# Altium schematic sheet SmartChargerV3.SchDoc
size 594 x 420 mm; SheetNumber: 1; SheetTotal: 1
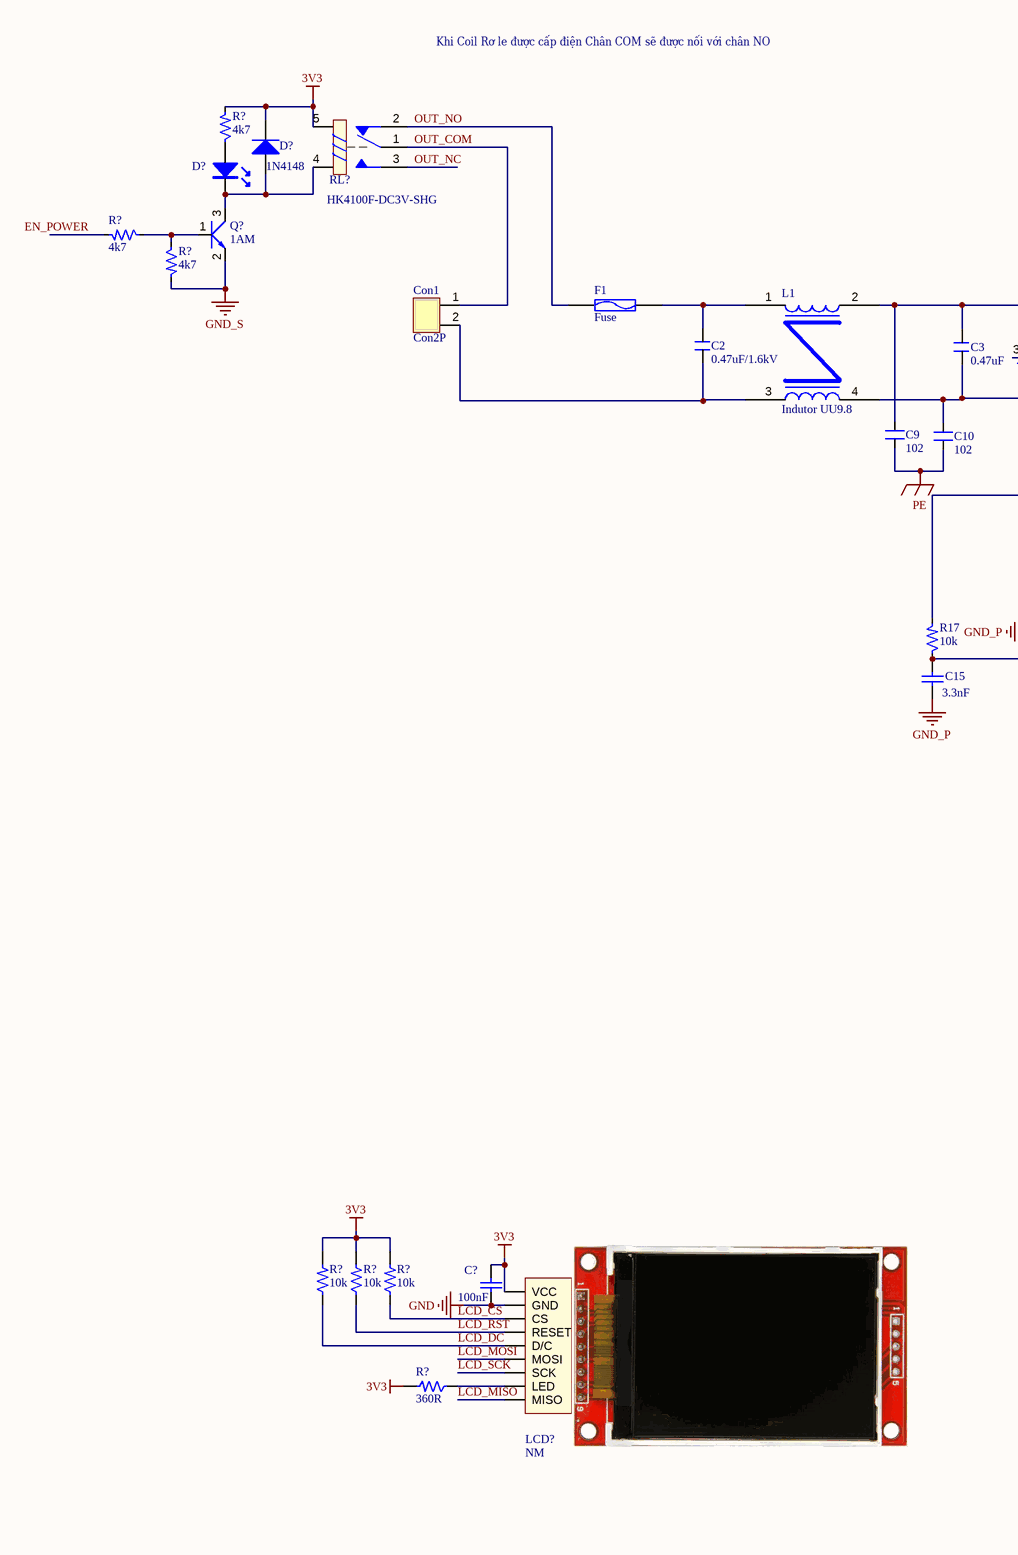
[diagram p0: SmartChargerV3.SchDoc, left]
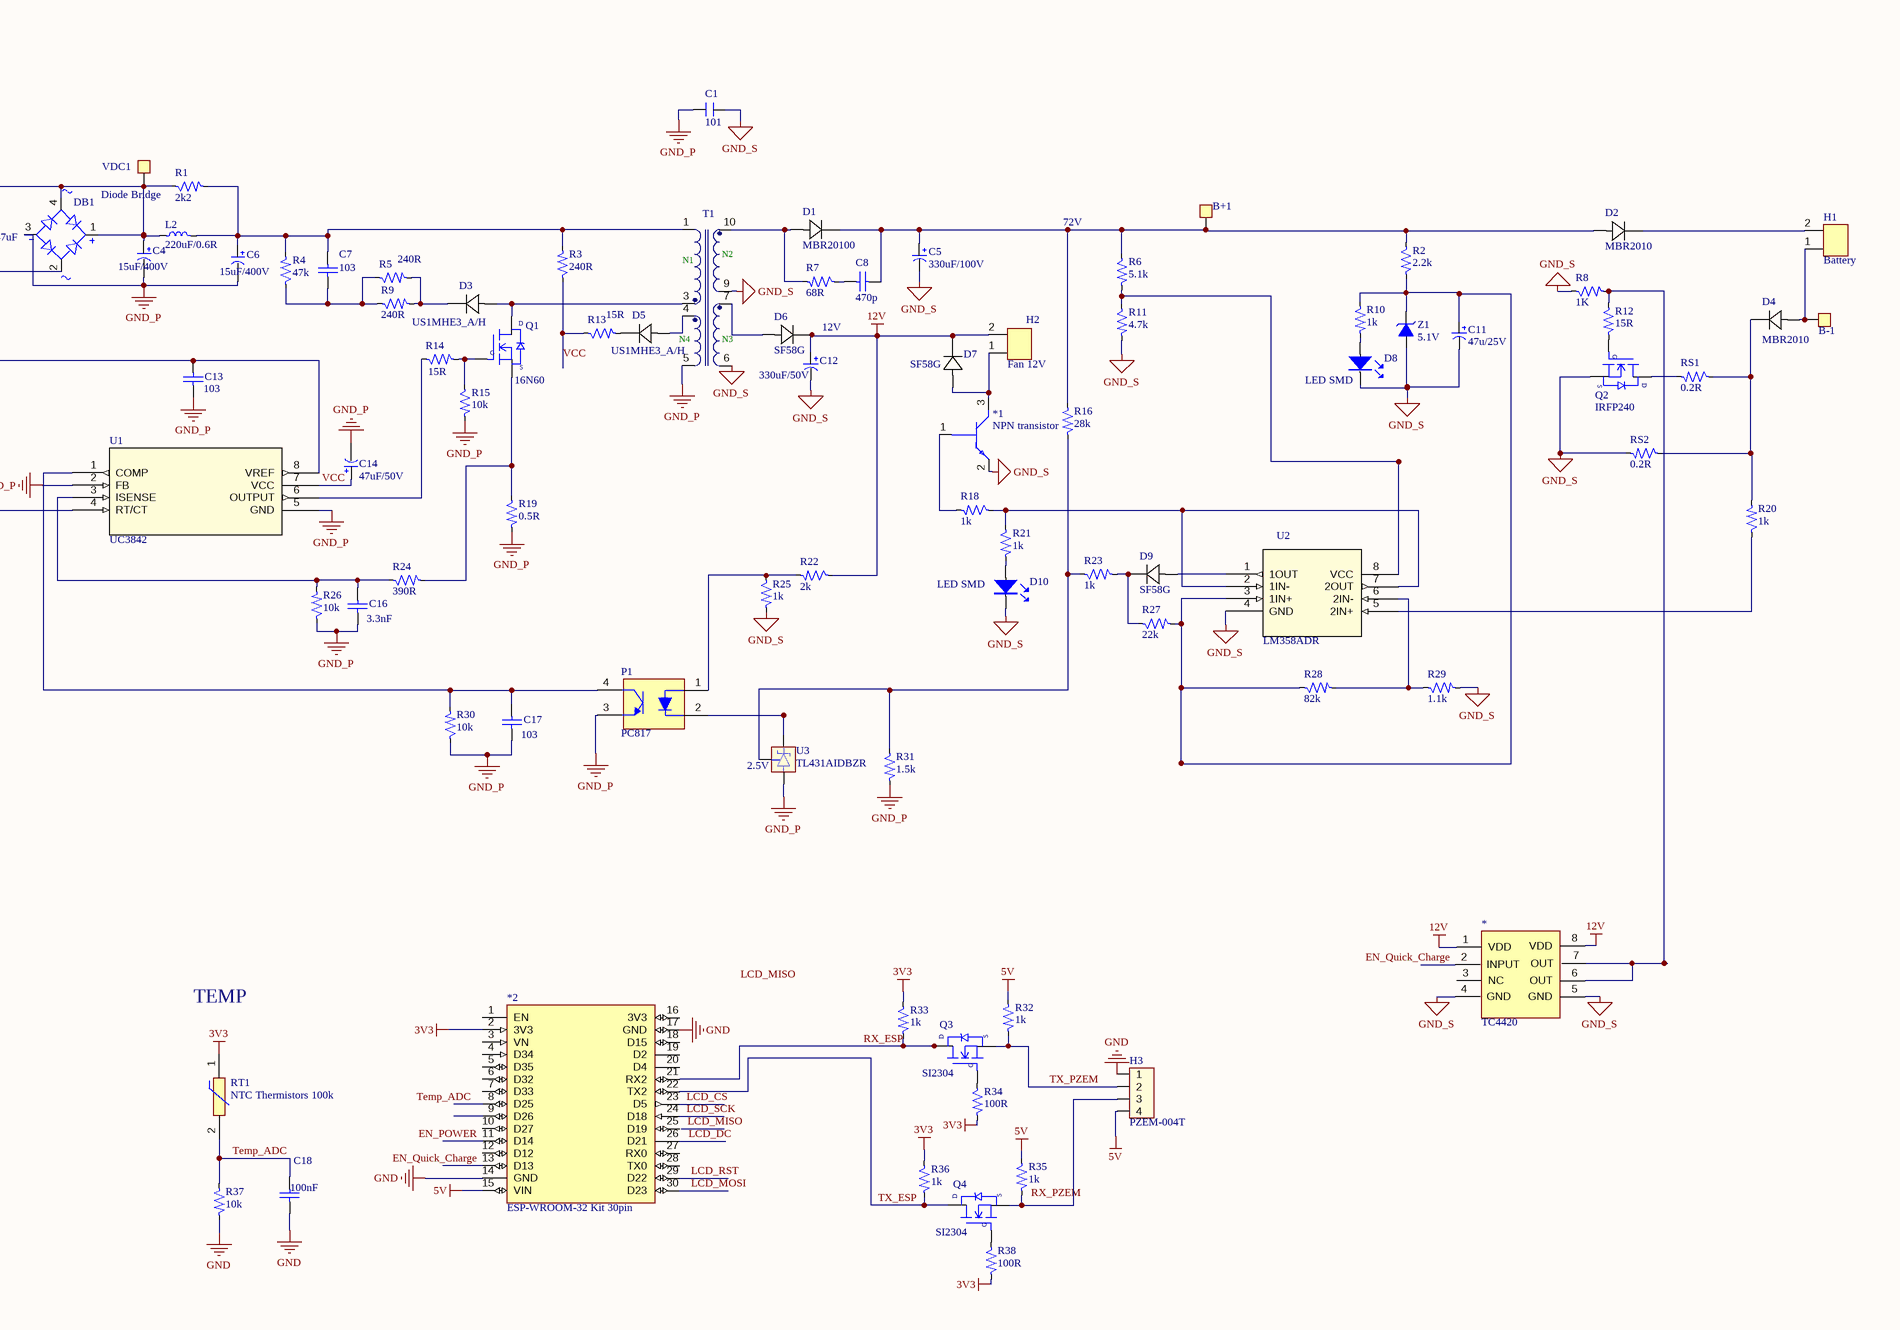
[diagram p1: SmartChargerV3.SchDoc, right]

## Parts
(Parts that share a designator on the sheet are numbered #1, #2 ... from top to bottom, then left to right.)
*  TC4420  [SOIC-8 127P 600X175]
*1  NPN transistor
*2  ESP-WROOM-32 Kit 30pin  [ESP-WROOM-32]
B+1  TEST POINT  [TEST POINT]  (value not drawn)
B-1  TEST POINT  [TEST POINT]  (value not drawn)
C1  101  [CN3]
C2  0.47uF/1.6kV  [Cap CBB]
C3  0.47uF  [Cap CBB]
C4  15uF/400V  [CAP 47uF 400V]
C5  330uF/100V  [CAP-ALU-SMD_B-4.0x5.4]
C6  15uF/400V  [CAP 47uF 400V]
C7  103  [CAP-SMD-0805]
C8  470p  [CAP-SMD-1206]
C9  102  [C-SE-7,5x10x9x5x4]
C10  102  [C-SE-7,5x10x9x5x4]
C11  47u/25V  [CAP-ALU-SMD_B-4.0x5.4]
C12  330uF/50V  [CAP-ALU-SMD_B-4.0x5.4]
C13  103  [CAP-SMD-1206]
C14  47uF/50V  [CAP 47uF 400V]
C15  3.3nF  [CAP-SMD-1206]
C16  3.3nF  [CAP-SMD-1206]
C17  103  [CAP-SMD-1206]
C18  100nF  [CAP-SMD-0603]
C?  100nF  [CAP-SMD-0603]
Con1  Con2P  [Con2 APES]
D1  MBR20100  [DO-214AC]
D2  MBR2010  [DO-214AC]
D3  US1MHE3_A/H  [DO-214AC]
D4  MBR2010  [DO-214AC]
D5  US1MHE3_A/H  [DO-214AC]
D6  SF58G  [DO-214AC]
D7  SF58G  [DO-214AC]
D8  LED SMD  [LED-0805-Blue]
D9  SF58G  [DO-214AC]
D10  LED SMD  [LED-0805-Blue]
D?#1  1N4148  [D-SMD-123]
D?#2  YELL  [LED-0603-Yellow]  (value not drawn)
DB1  Diode Bridge  [DIOB_MB10F-13]
F1  Fuse  [Fuse]
H1  Battery  [Con2 APES]
H2  Fan 12V  [Con2 APES]
H3  PZEM-004T  [Header 4P 2.0mm]
L1  Indutor UU9.8  [Inductor UU9.8]
L2  220uF/0.6R  [L-100uH 3A 8x10 DIP]
LCD?  NM  [LCD-TFT-SPI-2.2 ILI9341]
P1  PC817  [PC817_SMD]
Q1  16N60  [QTO-220H2]
Q2  IRFP240  [QTO-220H2]
Q3  SI2304  [QTO-220H2]
Q4  SI2304  [QTO-220H2]
Q?  1AM  [SOT-23]
R1  2k2  [RES-SMD-0805]
R2  2.2k  [RES-SMD-0805]
R3  240R  [RES-SMD-1206]
R4  47k  [RES-SMD-1206]
R5  240R  [RES-SMD-1206]
R6  5.1k  [RES-SMD-0805]
R7  68R  [RES-SMD-0805]
R8  1K  [RES-SMD-0805]
R9  240R  [RES-SMD-1206]
R10  1k  [RES-SMD-0805]
R11  4.7k  [RES-SMD-0805]
R12  15R  [RES-SMD-2512]
R13  15R  [RES-SMD-1206]
R14  15R  [RES-SMD-1206]
R15  10k  [RES-SMD-1206]
R16  28k  [RES-SMD-0805]
R17  10k  [RES-SMD-0805]
R18  1k  [RES-SMD-0805]
R19  0.5R  [RES-SMD-1206]
R20  1k  [RES-SMD-0805]
R21  1k  [RES-SMD-0805]
R22  2k  [RES-SMD-0805]
R23  1k  [RES-SMD-0805]
R24  390R  [RES-SMD-1206]
R25  1k  [RES-SMD-0805]
R26  10k  [RES-SMD-0805]
R27  22k  [RES-SMD-0805]
R28  82k  [RES-SMD-0805]
R29  1.1k  [RES-SMD-0805]
R30  10k  [RES-SMD-0805]
R31  1.5k  [RES-SMD-0805]
R32  1k  [RES-SMD-0603]
R33  1k  [RES-SMD-0603]
R34  100R  [RES-SMD-0603]
R35  1k  [RES-SMD-0603]
R36  1k  [RES-SMD-0603]
R37  10k  [RES-SMD-0603]
R38  100R  [RES-SMD-0603]
R?#1  4k7  [RES-SMD-0603]
R?#2  4k7  [RES-SMD-0603]
R?#3  4k7  [RES-SMD-0603]
R?#4  10k  [RES-SMD-0603]
R?#5  10k  [RES-SMD-0603]
R?#6  10k  [RES-SMD-0603]
R?#7  360R  [RES-SMD-0603]
RL?  HK4100F-DC3V-SHG  [RELAY-HK4100F-DC3V-SHG]
RS1  0.2R  [RES-SMD-2010]
RS2  0.2R  [RES-SMD-2010]
RT1  NTC Thermistors 100k  [NTC]
T1  (no value)  [TRANSFORMER EE20]
U1  UC3842  [SOIC-8]
U2  LM358ADR  [SOIC-8]
U3  TL431AIDBZR  [SOT-23]
VDC1  TEST POINT  [TEST POINT]  (value not drawn)
Z1  5.1V  [SOD-80]

## Nets
3V3: *2.2(3V3) C?.1 D?#1.2(K) LCD?.1(VCC) R33.1 R34.2 R36.1 R38.2 R?#1.2 R?#4.2 R?#5.2 R?#6.2 R?#7.2 RL?.5 RT1.1
5V: *2.15(VIN) H3.4 R32.1 R35.1
12V: *.1(VDD) *.8(VDD) C12.1 D6.1 D7.1 H2.2 R22.1
GND: *2.14(GND) *2.17(GND) C18.1 C?.2 H3.1 LCD?.2(GND) R37.2
GND_P: C1.1 C4.2 C6.2 C13.1 C14.2 C15.1 C16.1 C17.1 DB1.3(NEG) P1.3 R15.2 R19.2 R26.1 R30.1 R31.2 T1.5 U1.2(FB) U1.5(GND) U3.3(ANODE)
GND_S: *.4(GND) *.5(GND) *1.2(E) C1.2 C5.2 C11.2 C12.2 D8.2 D10.2 Q2.2(S) Q?.2(E) R8.1 R11.2 R25.2 R29.2 R?#3.2 RS2.2 T1.6 T1.9 U2.4(GND) Z1.1
PE: C9.1 C10.1
EN_POWER: *2.11(D14) R?#2.2
EN_Quick_Charge: *.2(INPUT) *2.13(D13)
LCD_CS: *2.23(D5) LCD?.3(CS) R?#6.1
LCD_DC: *2.26(D21) LCD?.5(D/C) R?#4.1
LCD_MISO: LCD?.9(MISO)
LCD_MOSI: *2.30(D23) LCD?.6(MOSI)
LCD_RST: *2.29(D22) LCD?.4(RESET) R?#5.1
LCD_SCK: *2.24(D18) LCD?.7(SCK)
OUT_COM: Con1.1 RL?.1
OUT_NC: RL?.3
OUT_NO: F1.1 RL?.2
RX_ESP: *2.21(RX2) Q3.3(D) R33.2
Temp_ADC: *2.8(D25) C18.2 R37.1 RT1.2
TX_ESP: *2.22(TX2) Q4.3(D) R36.2
TX_PZEM: H3.2 Q3.2(S) R32.2
VCC: C14.1 R3.1 R13.1 U1.7(VCC)
Net*1_1: *1.1(B) R18.2
Net*1_3: *1.3(C) D7.2 H2.1
Net*_6: *.6(OUT) *.7(OUT) R8.2 R12.1
NetB+1_1: B+1.1 C5.1 C8.2 D1.1 D2.2 R2.1 R6.1 R16.1
NetB-1_1: B-1.1 D4.2 H1.1
NetC2_1: C2.1 Con1.2 L1.3
NetC2_2: C2.2 F1.2 L1.1
NetC3_1: C3.1 C10.2 DB1.2(AC1) L1.4
NetC3_2: C3.2 C4.1 C9.2 DB1.1(POS) DB1.4(AC2) L1.2 L2.1 R1.1
NetC6_1: C6.1 C7.2 L2.2 R1.2 R3.2 R4.2 T1.1
NetC7_1: C7.1 R4.1 R5.1 R9.1
NetC8_1: C8.1 R7.1
NetC11_1: C11.1 R2.2 R10.1 R27.2 R28.1 U2.3(1IN+) Z1.2
NetC13_2: C13.2 R17.2 U1.8(VREF)
NetC15_2: C15.2 R17.1 U1.4(RT/CT)
NetC16_2: C16.2 R24.1 R26.2 U1.3(ISENSE)
NetC17_2: C17.2 P1.4 R30.2 U1.1(COMP)
NetD1_2: D1.2 R7.2 T1.10
NetD2_1: D2.1 H1.2
NetD3_1: D3.1 R5.2 R9.2
NetD3_2: D3.2 Q1.3(D) T1.3
NetD4_1: D4.1 R20.2 RS1.1 RS2.1
NetD5_1: D5.1 R13.2
NetD5_2: D5.2 T1.4
NetD6_2: D6.2 T1.7
NetD8_1: D8.1 R10.2
NetD9_1: D9.1 R23.2 R27.1
NetD9_2: D9.2 U2.1(1OUT)
NetD10_1: D10.1 R21.2
NetD?#1_1: D?#1.1(A) D?#2.2 Q?.3(C) RL?.4
NetD?#2_1: D?#2.1 R?#1.1
NetH3_3: H3.3 Q4.2(S) R35.2
NetLCD?_8: LCD?.8(LED) R?#7.1
NetP1_1: P1.1 R22.2 R25.1
NetP1_2: P1.2 U3.2(CATHODE)
NetQ1_1: Q1.1(G) R14.2 R15.1
NetQ1_2: Q1.2(S) R19.1 R24.2
NetQ2_1: Q2.1(G) R12.2
NetQ2_3: Q2.3(D) RS1.2
NetQ3_1: Q3.1(G) R34.1
NetQ4_1: Q4.1(G) R38.1
NetQ?_1: Q?.1(B) R?#2.1 R?#3.1
NetR6_2: R6.2 R11.1 U2.8(VCC)
NetR14_1: R14.1 U1.6(OUTPUT)
NetR16_2: R16.2 R23.1 R31.1 U3.1(REF)
NetR18_1: R18.1 R21.1 U2.2(1IN-) U2.7(2OUT)
NetR20_1: R20.1 U2.5(2IN+)
NetR28_2: R28.2 R29.1 U2.6(2IN-)

Not connected (* = marked no-connect by the designer): * 3(NC); *2 1(EN) 3(VN) 4(D34) 5(D35) 6(D32) 7(D33) 9(D26) 10(D27) 12(D12) 16(3V3) 18(D15) 19(D2) 20(D4) 25(D19) 27(RX0) 28(TX0); VDC1 1

## Notes on the sheet
- Khi Coil Rơ le được cấp điện Chân COM sẽ được nối với chân NO
- 72V
- 12V
- (near U3) 2.5V
- TEMP
- Labels drawn without touching a wire or pin: LCD_MISO, RX_PZEM
- DWG NO:
- REV:
- THIS DOCUMENT AND THE DATA DISCLOSED HEREIN OR
- HEREWITH IS THE PROPERTY OF ALTIUM LIMITED AND MAY
- BE FREELY DISTRIBUTED IN WHOLE. NO RIGHTS ARE
- RESERVED OR EXPRESS OR IMPLIED WARANTEE GIVEN.
- REVISION
- DESCRIPTION
- DATE
- APPROVED
- ENG:
- APPROVALS
- PROJECT
- DSN:
- CHK:
- REFERENCE DOCUMENTS
- PROJECT REVISION:
- TITLE
- DOCUMENT REVISION:
- DESIGN ITEM:
- BOM:
- FAB DWG:
- PCB DWG:
- ASSY DWG:
- SCALE:
- A2
- SIZE
- CAGE CODE
- FILE NAME
- DWG NO.
- SHEET
- OF
- REV
- (in symbol TRANSFORMER PULSE) N2; N1; N4; N3

## Library data of the parts
C1 C3 = Cap: 0.47uF/1.6kV
C2 = Cap
C4 C6 C14 = Cap_electric: cap
C5 C11 C12 = Cap_smd: cap smd
C7 C8 C13 C15-C18 C? = CAP SMD: Capacitor; Value: 33p; Published: 8-Jun-2000; LatestRevisionDate: 17-Jul-2002; LatestRevisionNote: Re-released for DXP Platform.; PackageReference: RAD-0.3; Publisher: Altium Limited
C9 C10 = CN-SEMI-DIP: Capacitor (Semiconductor SIM Model); Value: 104; LatestRevisionDate: 17-Jul-2002; LatestRevisionNote: Re-released for DXP Platform.; PackageReference: C1206; Publisher: Altium Limited
Con1 H1 H2 = connector2P
D1-D7 D9 = Diode Rectifier: Surface-Mount Ultrafast Rectifier
D?#1 = DIODE: Diode Normal; Published: 8-Jun-2000; LatestRevisionDate: 17-Jul-2002; LatestRevisionNote: Re-released for DXP Platform.; DatasheetDocument: 1997; PackageReference: DO-35; Publisher: Altium Limited; Code_JEDEC: DO-204-AH; ComponentLink1Description: Manufacturer Link; ComponentLink1URL: http://www.fairchildsemi.com/; ComponentLink2Description: Datasheet; ComponentLink2URL: http://www.fairchildsemi.com/ds/1N%2F1N4448.pdf
D?#2 = LED SMD
H3 = Header 4P: Connector 2; Value: Connector 2
L1 = Inductor UU9.8: Cuộn Lọc 10mH UU9.8
L2 = L DIP
LCD? = LCD-TFT_SPI: Value: JP7
P1 = PC817: Opto; Published: 8-Jun-2000; LatestRevisionDate: 15-Jan-2003; LatestRevisionNote: PCB Footprint 'BCY-W3/D4.7' replaced; DatasheetDocument: 1997; PackageReference: TO-92A; Publisher: Altium Limited; Code_JEDEC: TO-92A
Q1 Q2 = MOSFET N-Chanel: N-Channel 600V 6A (Ta) 1.4W (Ta) Surface Mount SOT-23-3L; MF: Alpha & Omega Semiconductor; MP: AO3401; Price: None; SnapEDA_Link: https://www.snapeda.com/parts/AO3401/Alpha%20&%20Omega%20Semiconductor/view-part/4795619/?ref=snap; Arrow_Electronics-Purchase-URL: https://snapeda.com/shop?store=Arrow+Electronics&id=4795619; Availability: Warning; Value: *; Package: SOT-23-3 Alpha &amp; Omega Semiconductor
Q3 Q4 = MOSFET N-Chanel: N-Channel 30V 4A (Ta) 1.4W (Ta) Surface Mount SOT-23-3L; MF: Alpha & Omega Semiconductor; MP: AO3401; Price: None; SnapEDA_Link: https://www.snapeda.com/parts/AO3401/Alpha%20&%20Omega%20Semiconductor/view-part/4795619/?ref=snap; Arrow_Electronics-Purchase-URL: https://snapeda.com/shop?store=Arrow+Electronics&id=4795619; Availability: Warning; Value: *; Package: SOT-23-3 Alpha &amp; Omega Semiconductor
Q? = C1815: NPN 600mW, ECB; Value: C1815
R1-R38 R?#1-R?#7 = RES SMD: Resistor SMD; Value: R1/4W - 1K
RL? = Relay 10A: Relay SPDT,10A - 12VDC 5 Pin
RS1 RS2 = RES SMD: R shunt; Value: R1/4W - 1K
RT1 = NTC Thermistors: Epoxy Coated NTC Thermistors; Manufacturer_Name: Cantherm; Manufacturer_Part_Number: MF52A1104J3950; Datasheet Link: https://www.cantherm.com/wp-content/uploads/2017/05/cantherm_mf52_1.pdf; Height: 4mm
T1 = TRANSFORMER PULSE: Resonant Converter WE-LLCR, Ui=360-400 V (DC); PartNo: 760895441; Manufacturer: Würth Elektronik eiSos GmbH; OutPut Voltage: 24 V; Output Current: 6.2A; (Input Voltage) Ui: 360-400 V (DC); ComponentLink1Description: Manufacturer; ComponentLink1URL: http://www.we-online.de; Created by: Otto Christin; Created Date: NOV 2013; ComponentLink2Description: Datasheet; ComponentLink2URL: http://katalog.we-online.de/pbs/datasheet/760895441.pdf
U3 = TL431AIDBZR: Shunt Voltage Reference IC 36V Â±1% SOT-23-3; MF: Texas Instruments; Package: SOT-23-3 Nexperia; Value: *; Availability: Unavailable; MP: TL431AIDBZR; Price: None; SnapEDA_Link: https://www.snapeda.com/parts/TL431AIDBZR/Texas%20Instruments/view-part/2175246/?ref=snap
Z1 = DIODE Zener: Diode  Zener